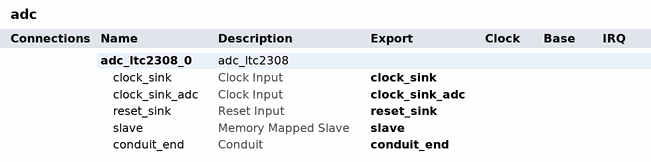
[diagram p0: system contents]
# Platform Designer (Qsys) system adc, Cyclone V 5CSEBA6U23I7
# Parameters at their usual value, and those the tool derives, are not listed.
package require qsys
create_system adc
set_project_property DEVICE_FAMILY {Cyclone V}
set_project_property DEVICE 5CSEBA6U23I7

add_instance adc_ltc2308_0 adc_ltc2308 1.1
set_instance_property adc_ltc2308_0 AUTO_EXPORT true

# exported interfaces
add_interface clock_sink clock sink
set_interface_property clock_sink EXPORT_OF adc_ltc2308_0.clock_sink
add_interface clock_sink_adc clock sink
set_interface_property clock_sink_adc EXPORT_OF adc_ltc2308_0.clock_sink_adc
add_interface conduit_end conduit end
set_interface_property conduit_end EXPORT_OF adc_ltc2308_0.conduit_end
add_interface reset_sink reset sink
set_interface_property reset_sink EXPORT_OF adc_ltc2308_0.reset_sink
add_interface slave avalon slave
set_interface_property slave EXPORT_OF adc_ltc2308_0.slave

set_interconnect_requirement {$system} qsys_mm.clockCrossingAdapter HANDSHAKE
set_interconnect_requirement {$system} qsys_mm.enableEccProtection FALSE
set_interconnect_requirement {$system} qsys_mm.insertDefaultSlave FALSE
set_interconnect_requirement {$system} qsys_mm.maxAdditionalLatency 1

save_system adc.qsys
